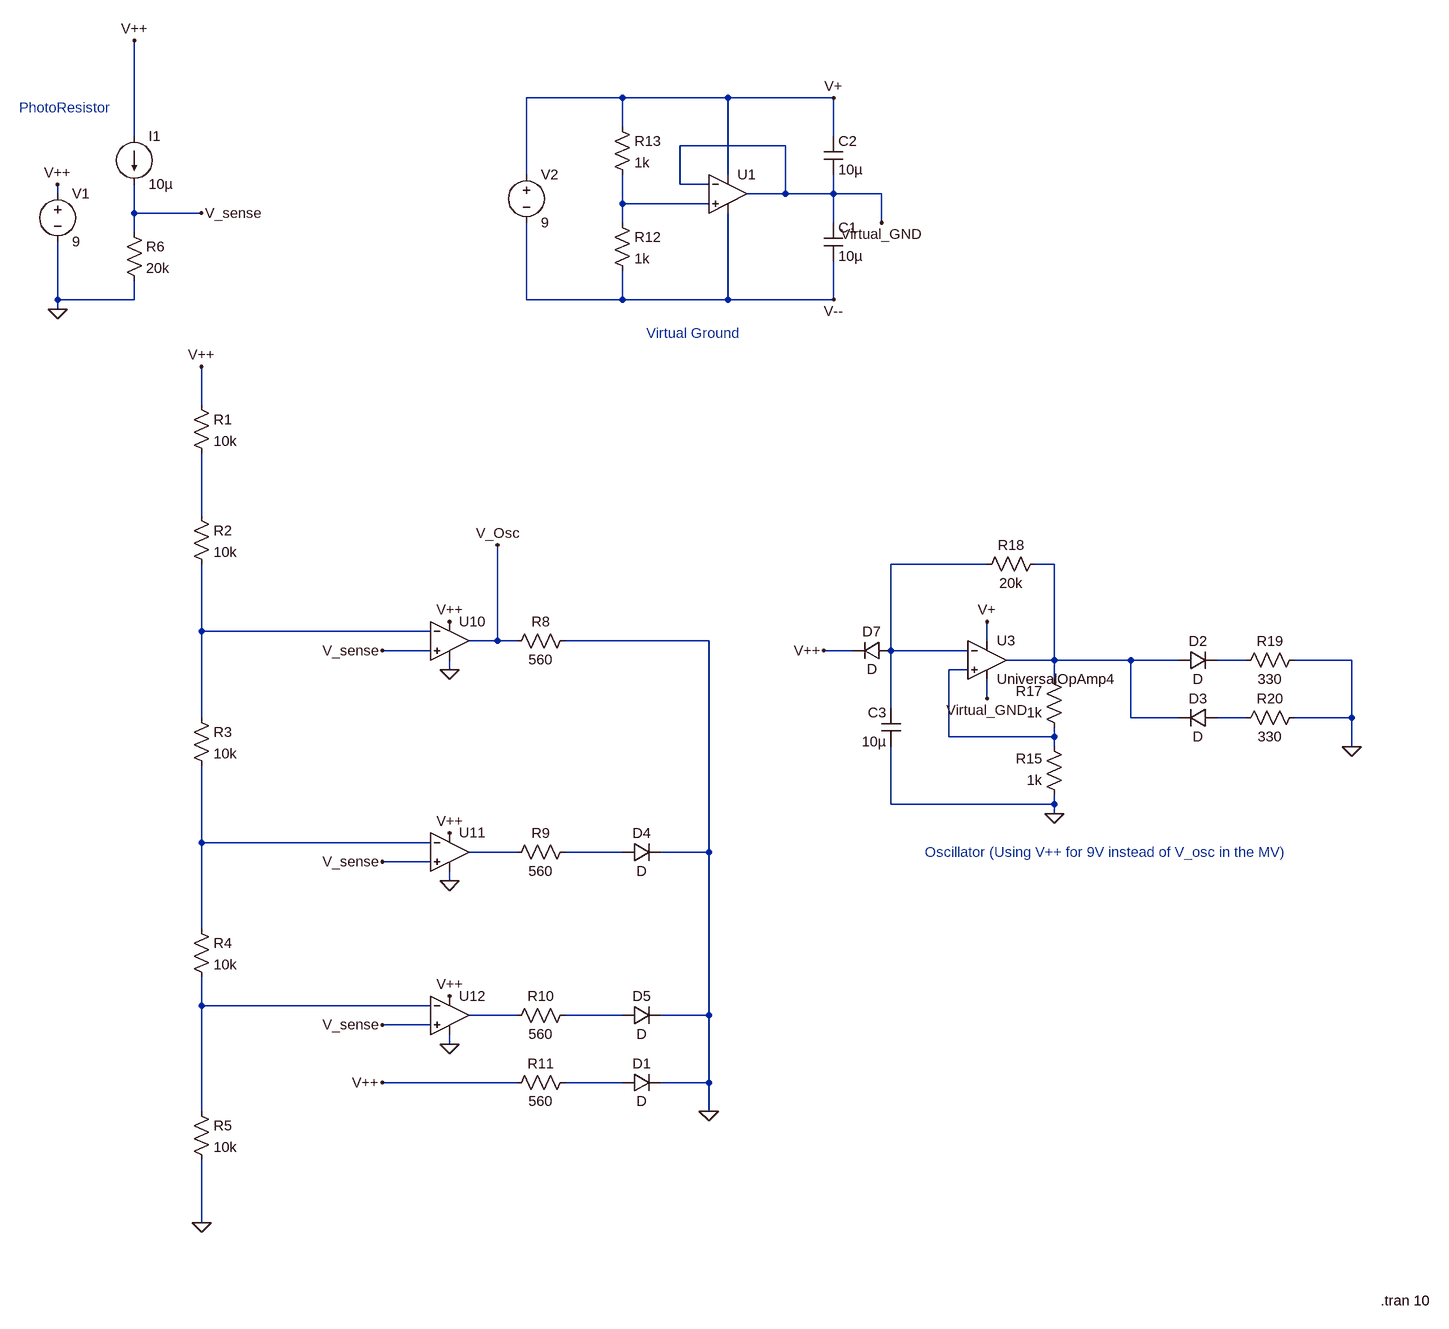
[diagram p0: schematic PhotoSensor LEDs.asc]
PhotoSensor LEDs.asc, the LTspice schematic file:
Version 4
SHEET 1 3108 1732
WIRE -1520 -1792 -1680 -1792
WIRE -1344 -1792 -1520 -1792
WIRE -1168 -1792 -1344 -1792
WIRE -1520 -1744 -1520 -1792
WIRE -2352 -1728 -2352 -1888
WIRE -1168 -1728 -1168 -1792
WIRE -1248 -1712 -1424 -1712
WIRE -1680 -1664 -1680 -1792
WIRE -1344 -1664 -1344 -1792
WIRE -1424 -1648 -1424 -1712
WIRE -1376 -1648 -1424 -1648
WIRE -2480 -1632 -2480 -1648
WIRE -1248 -1632 -1248 -1712
WIRE -1248 -1632 -1312 -1632
WIRE -1168 -1632 -1168 -1664
WIRE -1168 -1632 -1248 -1632
WIRE -1088 -1632 -1168 -1632
WIRE -1520 -1616 -1520 -1664
WIRE -1376 -1616 -1520 -1616
WIRE -2352 -1600 -2352 -1648
WIRE -2240 -1600 -2352 -1600
WIRE -1520 -1584 -1520 -1616
WIRE -1168 -1584 -1168 -1632
WIRE -1088 -1584 -1088 -1632
WIRE -2352 -1568 -2352 -1600
WIRE -2480 -1456 -2480 -1552
WIRE -2352 -1456 -2352 -1488
WIRE -2352 -1456 -2480 -1456
WIRE -1680 -1456 -1680 -1584
WIRE -1520 -1456 -1520 -1504
WIRE -1520 -1456 -1680 -1456
WIRE -1344 -1456 -1344 -1600
WIRE -1344 -1456 -1520 -1456
WIRE -1168 -1456 -1168 -1520
WIRE -1168 -1456 -1344 -1456
WIRE -2480 -1440 -2480 -1456
WIRE -2240 -1280 -2240 -1344
WIRE -2240 -1040 -2240 -1200
WIRE -912 -960 -1072 -960
WIRE -800 -960 -832 -960
WIRE -2240 -848 -2240 -960
WIRE -1840 -848 -2240 -848
WIRE -1728 -832 -1728 -992
WIRE -1728 -832 -1776 -832
WIRE -1696 -832 -1728 -832
WIRE -1376 -832 -1616 -832
WIRE -912 -832 -912 -864
WIRE -1840 -816 -1920 -816
WIRE -1136 -816 -1184 -816
WIRE -1072 -816 -1072 -960
WIRE -944 -816 -1072 -816
WIRE -800 -800 -800 -960
WIRE -800 -800 -880 -800
WIRE -672 -800 -800 -800
WIRE -592 -800 -672 -800
WIRE -480 -800 -528 -800
WIRE -304 -800 -400 -800
WIRE -1808 -784 -1808 -800
WIRE -944 -784 -976 -784
WIRE -800 -768 -800 -800
WIRE -912 -736 -912 -768
WIRE -1072 -720 -1072 -816
WIRE -2240 -704 -2240 -848
WIRE -672 -704 -672 -800
WIRE -592 -704 -672 -704
WIRE -480 -704 -528 -704
WIRE -304 -704 -304 -800
WIRE -304 -704 -400 -704
WIRE -976 -672 -976 -784
WIRE -800 -672 -800 -688
WIRE -800 -672 -976 -672
WIRE -800 -656 -800 -672
WIRE -304 -656 -304 -704
WIRE -1072 -560 -1072 -656
WIRE -800 -560 -800 -576
WIRE -800 -560 -1072 -560
WIRE -800 -544 -800 -560
WIRE -2240 -496 -2240 -624
WIRE -1840 -496 -2240 -496
WIRE -1696 -480 -1776 -480
WIRE -1520 -480 -1616 -480
WIRE -1376 -480 -1376 -832
WIRE -1376 -480 -1456 -480
WIRE -1840 -464 -1920 -464
WIRE -1808 -432 -1808 -448
WIRE -2240 -352 -2240 -496
WIRE -2240 -224 -2240 -272
WIRE -1840 -224 -2240 -224
WIRE -1696 -208 -1776 -208
WIRE -1520 -208 -1616 -208
WIRE -1376 -208 -1376 -480
WIRE -1376 -208 -1456 -208
WIRE -1840 -192 -1920 -192
WIRE -1808 -160 -1808 -176
WIRE -1696 -96 -1920 -96
WIRE -1520 -96 -1616 -96
WIRE -1376 -96 -1376 -208
WIRE -1376 -96 -1456 -96
WIRE -2240 -48 -2240 -224
WIRE -1376 -48 -1376 -96
WIRE -2240 176 -2240 32
FLAG -1808 -864 V++
FLAG -1808 -512 V++
FLAG -1808 -240 V++
FLAG -1808 -784 0
FLAG -1808 -432 0
FLAG -1808 -160 0
FLAG -2480 -1440 0
FLAG -2480 -1648 V++
FLAG -2240 176 0
FLAG -2240 -1344 V++
FLAG -2352 -1888 V++
FLAG -2240 -1600 V_sense
FLAG -1920 -816 V_sense
FLAG -1920 -464 V_sense
FLAG -1920 -192 V_sense
FLAG -1376 -48 0
FLAG -1920 -96 V++
FLAG -800 -544 0
FLAG -304 -656 0
FLAG -1168 -1456 V--
FLAG -1168 -1792 V+
FLAG -912 -864 V+
FLAG -1184 -816 V++
FLAG -1728 -992 V_Osc
FLAG -1088 -1584 Virtual_GND
FLAG -912 -736 Virtual_GND
SYMBOL OpAmps\\UniversalOpAmp -1808 -832 R0
SYMATTR InstName U10
SYMBOL OpAmps\\UniversalOpAmp -1808 -480 R0
SYMATTR InstName U11
SYMBOL OpAmps\\UniversalOpAmp -1808 -208 R0
SYMATTR InstName U12
SYMBOL voltage -2480 -1648 R0
WINDOW 123 0 0 Left 0
WINDOW 39 0 0 Left 0
SYMATTR InstName V1
SYMATTR Value 9
SYMBOL res -2256 -1296 R0
SYMATTR InstName R1
SYMATTR Value 10k
SYMBOL res -2256 -1056 R0
SYMATTR InstName R2
SYMATTR Value 10k
SYMBOL res -2256 -720 R0
SYMATTR InstName R3
SYMATTR Value 10k
SYMBOL res -2256 -368 R0
SYMATTR InstName R4
SYMATTR Value 10k
SYMBOL res -2256 -64 R0
SYMATTR InstName R5
SYMATTR Value 10k
SYMBOL current -2352 -1728 R0
WINDOW 123 0 0 Left 0
WINDOW 39 0 0 Left 0
SYMATTR InstName I1
SYMATTR Value 10µ
SYMBOL res -2368 -1584 R0
SYMATTR InstName R6
SYMATTR Value 20k
SYMBOL res -1600 -848 R90
WINDOW 0 0 56 VBottom 2
WINDOW 3 32 56 VTop 2
SYMATTR InstName R8
SYMATTR Value 560
SYMBOL res -1600 -496 R90
WINDOW 0 0 56 VBottom 2
WINDOW 3 32 56 VTop 2
SYMATTR InstName R9
SYMATTR Value 560
SYMBOL res -1600 -224 R90
WINDOW 0 0 56 VBottom 2
WINDOW 3 32 56 VTop 2
SYMATTR InstName R10
SYMATTR Value 560
SYMBOL res -1600 -112 R90
WINDOW 0 0 56 VBottom 2
WINDOW 3 32 56 VTop 2
SYMATTR InstName R11
SYMATTR Value 560
SYMBOL diode -1520 -80 R270
WINDOW 0 32 32 VTop 2
WINDOW 3 0 32 VBottom 2
SYMATTR InstName D1
SYMBOL diode -1520 -464 R270
WINDOW 0 32 32 VTop 2
WINDOW 3 0 32 VBottom 2
SYMATTR InstName D4
SYMBOL diode -1520 -192 R270
WINDOW 0 32 32 VTop 2
WINDOW 3 0 32 VBottom 2
SYMATTR InstName D5
SYMBOL cap -1184 -1584 R0
SYMATTR InstName C1
SYMATTR Value 10µ
SYMBOL cap -1184 -1728 R0
SYMATTR InstName C2
SYMATTR Value 10µ
SYMBOL res -1536 -1600 R0
SYMATTR InstName R12
SYMATTR Value 1k
SYMBOL res -1536 -1760 R0
SYMATTR InstName R13
SYMATTR Value 1k
SYMBOL OpAmps\\UniversalOpAmp -1344 -1632 R0
SYMATTR InstName U1
SYMATTR Value2 Avol=1 GBW=10 Vos=0
SYMBOL voltage -1680 -1680 R0
WINDOW 123 0 0 Left 0
WINDOW 39 0 0 Left 0
SYMATTR InstName V2
SYMATTR Value 9
SYMBOL OpAmps\\UniversalOpAmp4 -912 -800 R0
SYMATTR InstName U3
SYMBOL res -784 -560 R180
WINDOW 0 36 76 Left 2
WINDOW 3 36 40 Left 2
SYMATTR InstName R15
SYMATTR Value 1k
SYMBOL res -784 -672 R180
WINDOW 0 36 76 Left 2
WINDOW 3 36 40 Left 2
SYMATTR InstName R17
SYMATTR Value 1k
SYMBOL res -816 -976 R90
WINDOW 0 0 56 VBottom 2
WINDOW 3 32 56 VTop 2
SYMATTR InstName R18
SYMATTR Value 20k
SYMBOL cap -1056 -656 R180
WINDOW 0 24 56 Left 2
WINDOW 3 24 8 Left 2
SYMATTR InstName C3
SYMATTR Value 10µ
SYMBOL diode -592 -784 R270
WINDOW 0 32 32 VTop 2
WINDOW 3 0 32 VBottom 2
SYMATTR InstName D2
SYMBOL diode -528 -720 R90
WINDOW 0 0 32 VBottom 2
WINDOW 3 32 32 VTop 2
SYMATTR InstName D3
SYMBOL res -384 -816 R90
WINDOW 0 0 56 VBottom 2
WINDOW 3 32 56 VTop 2
SYMATTR InstName R19
SYMATTR Value 330
SYMBOL res -384 -720 R90
WINDOW 0 0 56 VBottom 2
WINDOW 3 32 56 VTop 2
SYMATTR InstName R20
SYMATTR Value 330
SYMBOL diode -1072 -832 R90
WINDOW 0 0 32 VBottom 2
WINDOW 3 32 32 VTop 2
SYMATTR InstName D7
TEXT -256 1496 Left 2 !.tran 10
TEXT -1016 -480 Left 2 ;Oscillator (Using V++ for 9V instead of V_osc in the MV)
TEXT -2544 -1776 Left 2 ;PhotoResistor
TEXT -1480 -1400 Left 2 ;Virtual Ground

The netlist it stands for:
* PhotoSensor LEDs.asc
XU10 V_sense N005 V++ 0 V_Osc level1 Avol=1Meg GBW=10Meg Vos=0 En=0 Enk=0 In=0 Ink=0 Rin=500Meg  ; pins In+ In- V+ V- OUT
XU11 V_sense N009 V++ 0 N010 level1 Avol=1Meg GBW=10Meg Vos=0 En=0 Enk=0 In=0 Ink=0 Rin=500Meg  ; pins In+ In- V+ V- OUT
XU12 V_sense N012 V++ 0 N013 level1 Avol=1Meg GBW=10Meg Vos=0 En=0 Enk=0 In=0 Ink=0 Rin=500Meg  ; pins In+ In- V+ V- OUT
V1 V++ 0 9
R1 V++ N002 10k
R2 N002 N005 10k
R3 N005 N009 10k
R4 N009 N012 10k
R5 N012 0 10k
I1 V++ V_sense 10µ
R6 V_sense 0 20k
R8 0 V_Osc 560
R9 N011 N010 560
R10 N014 N013 560
R11 N015 V++ 560
D1 N015 0 D
D4 N011 0 D
D5 N014 0 D
C1 Virtual_GND V-- 10µ
C2 V+ Virtual_GND 10µ
R12 N001 V-- 1k
R13 V+ N001 1k
XU1 N001 Virtual_GND V+ V-- Virtual_GND level1 Avol=1 GBW=10 Vos=0 En=0 Enk=0 In=0 Ink=0 Rin=500Meg  ; pins In+ In- V+ V- OUT
V2 V+ V-- 9
* U3: UniversalOpAmp4 (symbol OpAmps\UniversalOpAmp4 not available, pins judged from their places): In+=N007 In-=N003 V+=V+ V-=Virtual_GND OUT=N004
R15 0 N007 1k
R17 N007 N004 1k
R18 N004 N003 20k
C3 0 N003 10µ
D2 N004 N006 D
D3 N008 N004 D
R19 0 N006 330
R20 0 N008 330
D7 N003 V++ D
.model D D
.lib standard.dio
.tran 10
* Oscillator (Using V++ for 9V instead of V_osc in the MV)
* PhotoResistor
* Virtual Ground
.lib UniversalOpAmp1.lib
.backanno
.end